# EAGLE design Gimbal_Breakout (EAGLE 6.6.0)
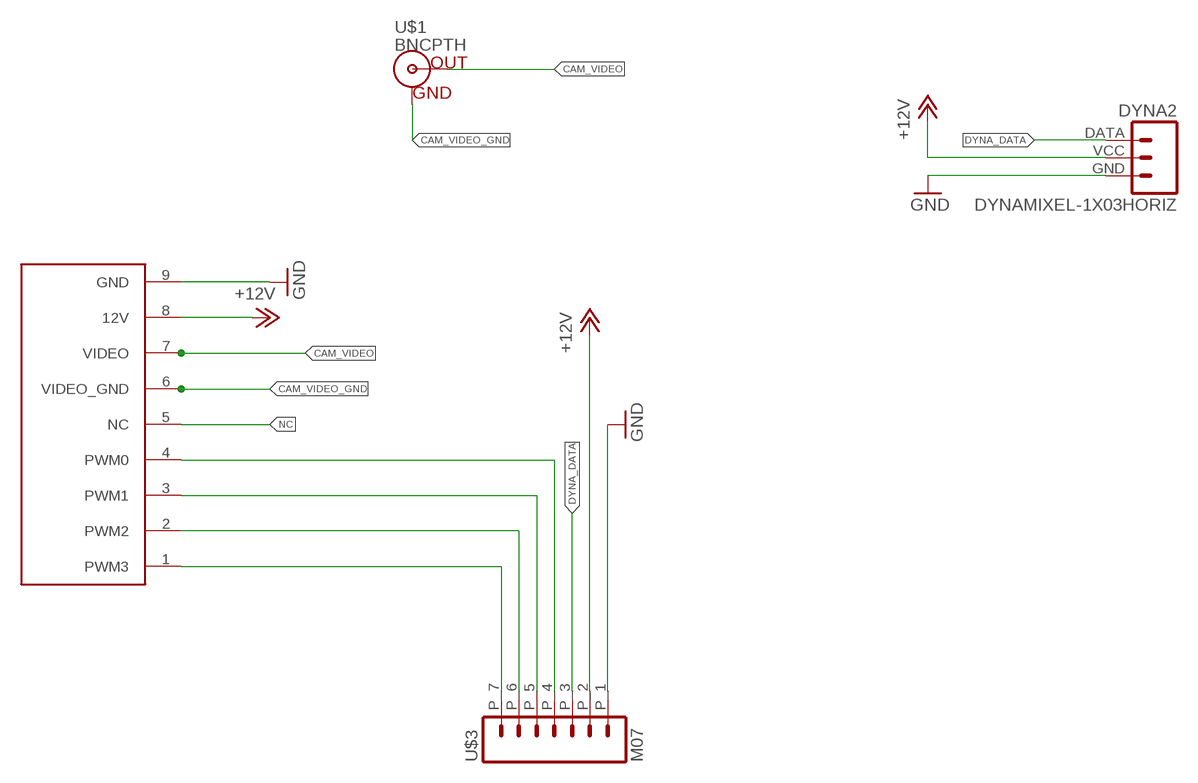
[diagram p0: schematic, sheet 1]

## Parts
DYNA2  DYNAMIXEL-1X03HORIZ  [MLX-SPOX5268-3PIN]
U$1  BNCPTH  [BNC]
U$3  M07  [MOLEX_43650-07]
U$4  CAMERA_BREAKOUT  [CAM_CONNECTOR]

## Nets
+12V: DYNA2.VCC U$3.P_2 U$4.8(12V)
CAM_PWM0: U$3.P_4 U$4.4(PWM0)
CAM_PWM1: U$3.P_5 U$4.3(PWM1)
CAM_PWM2: U$3.P_6 U$4.2(PWM2)
CAM_PWM3: U$3.P_7 U$4.1(PWM3)
CAM_VIDEO: U$1.S(OUT) U$4.7(VIDEO)
CAM_VIDEO_GND: U$1.GND U$4.6(VIDEO_GND)
DYNA_DATA: DYNA2.DATA U$3.P_3
GND: DYNA2.GND U$3.P_1 U$4.9(GND)
Unconnected: U$4.5(NC)

## Library data of the parts
DYNA2 = MRDT-2015-Arm:DYNAMIXEL-1X03; MFR: Molex; MFR_PN: 0022057035; ORIENT: Horiz
U$1 = SparkFun-Connectors:BNC: BNC Connector, Mouser Part# 5227161
U$3 = MRDT-Connectors:M07
U$4 = MRDT-2015-General:CAMERA_BREAKOUT: Breakout board for the rover's main camera

## Board
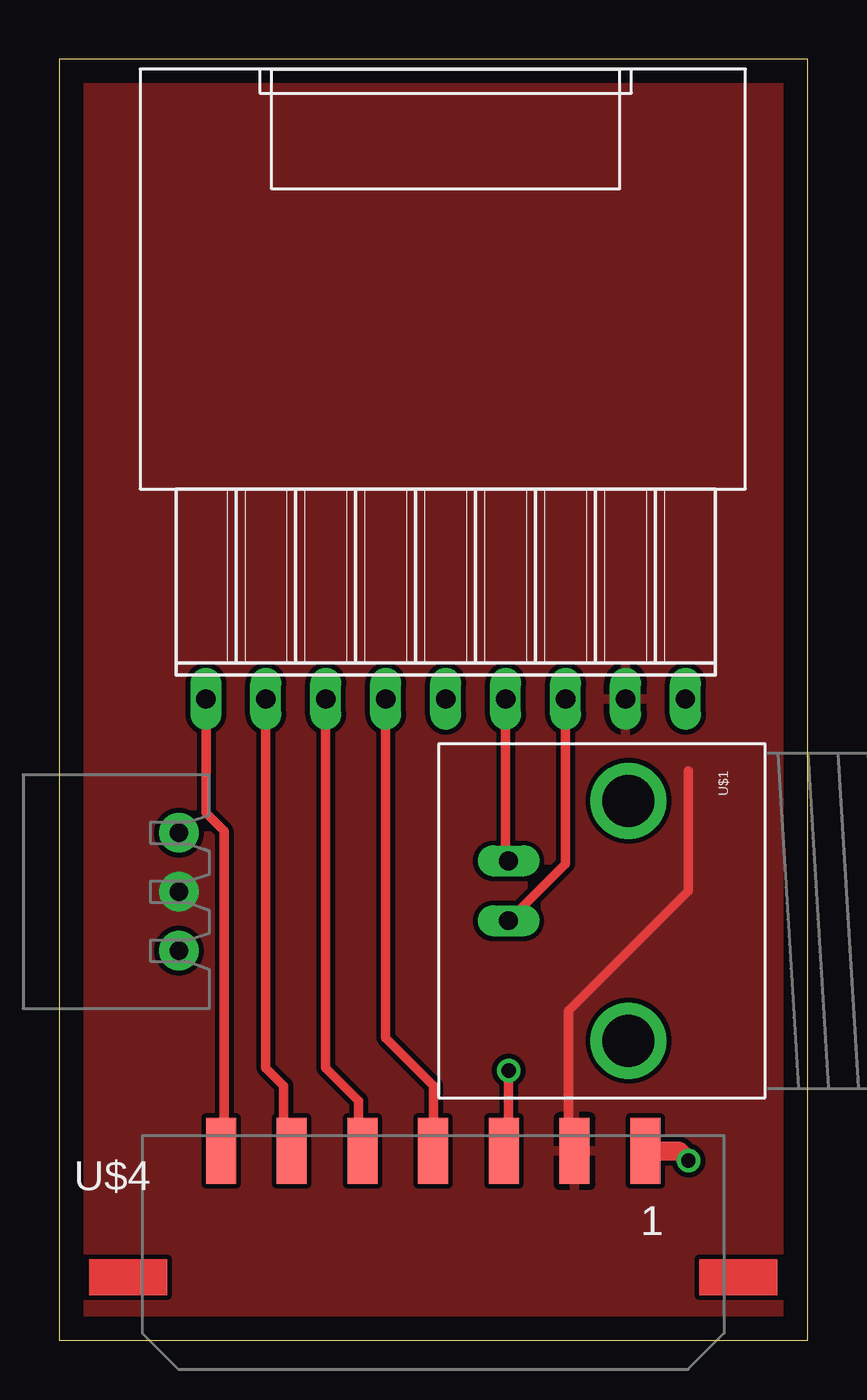
[diagram p1: board, top side]
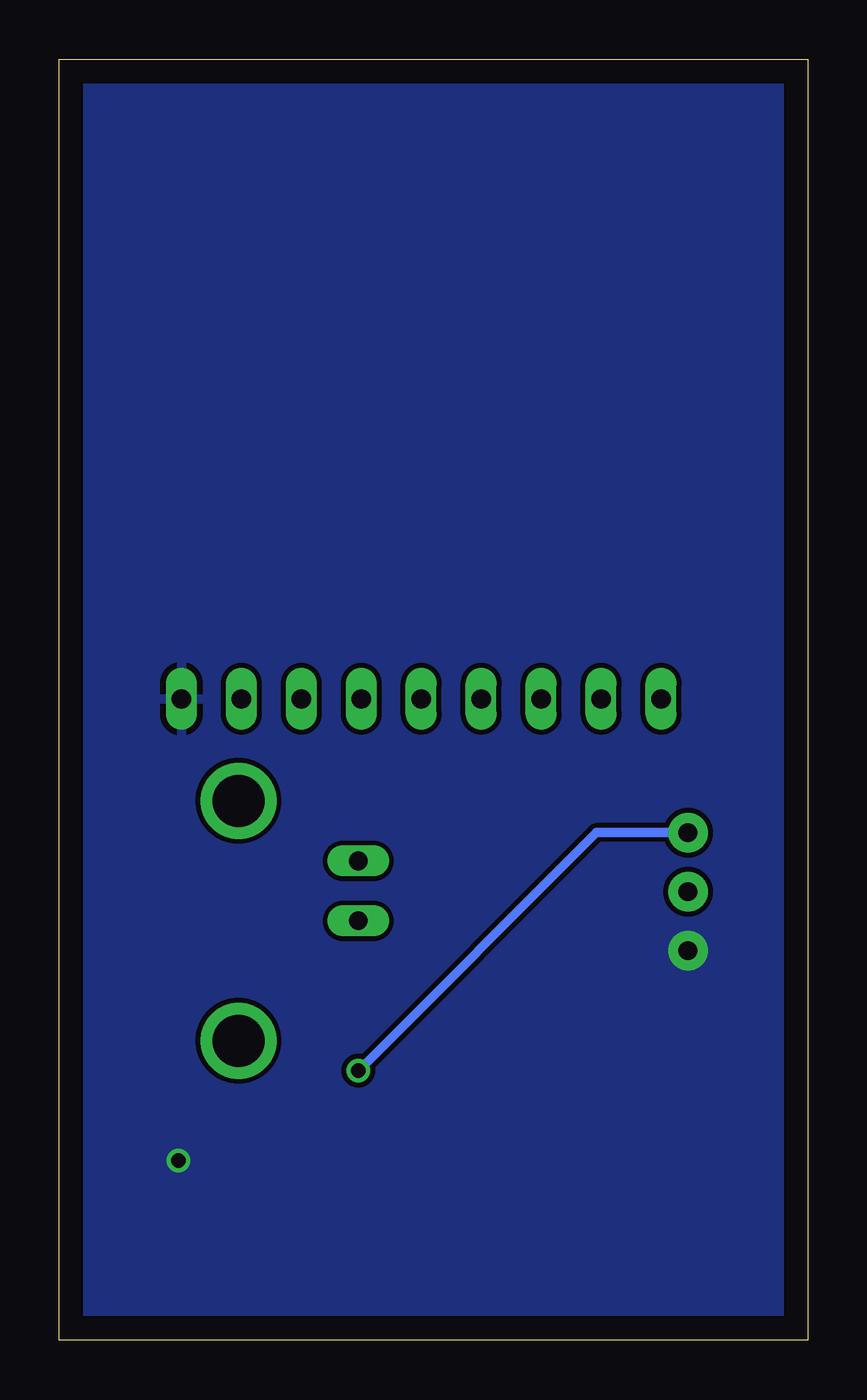
[diagram p2: board, bottom side, seen from below]

Size 31.73 x 54.28 mm. Coordinates in mm from the lower left corner, seen from the top.
Outline: 0,0 31.73,0 31.73,54.28 0,54.28 0,0
Copper layers (1*16): Top 0.035mm / dielectric 1.5mm / Bottom 0.035mm
Design rules "default": minimum track width 10mil, minimum drill 24mil, track to track 8mil, track to pad 8mil, pad to pad 8mil, via to via 8mil, smd to smd 8mil, copper to edge 40mil, drill to drill 8mil, minimum pad ring 10mil, minimum via ring 8mil, stop-mask expansion 4mil, vias tented up to drill 0mil, thermal gap 10mil

### Footprints (pad centres in the part's own frame; a part is rotated, then mirrored left to right if it is on the bottom)
MLX-SPOX5268-3PIN = drill 0.8 pad 1.676: DATA 5,0; GND 0,0; VCC 2.5,0
BNC = drill 2.2: 3 -5.08,5.08; 4 5.08,5.08 | drill 0.8 long: GND -2.54,0; S 0,0
MOLEX_43650-07 = smd 1.27 x 2.794: P_1 8.966,4.851; P_2 5.969,4.851; P_3 2.972,4.851; P_4 -0.025,4.851; P_5 -3.023,4.851; P_6 -6.02,4.851; P_7 -9.017,4.851
CAM_CONNECTOR = drill 0.813 long: 1 3.048,1.778; 2 5.588,1.778; 3 8.128,1.778; 4 10.668,1.778; 5 13.208,1.778; 6 15.748,1.778; 7 18.288,1.778; 8 20.828,1.778; 9 23.368,1.778

### Placement (x,y rotation side)
DYNA2  5.08,16.51 90 top
U$1  19.05,17.78 270 top
U$3  15.88,3.17 0 top
U$4  3.17,25.4 0 top

### Tracks (layer width: path | path; a pad name or v marks a point on that pad's centre or on a via)
+12V
  Top 0.406: U$4.8 24,26.8 | 26.67,24.13 26.67,19.05 21.59,13.97 21.59,8.28 U$3.P_2
  pour Top: -12.7,-7.62 58.42,-7.62 58.42,68.58 -12.7,68.58
CAM_PWM0
  Top 0.406: U$4.4 13.84,12.83 15.88,10.8 15.88,8.05 U$3.P_4
CAM_PWM1
  Top 0.406: U$4.3 11.3,11.56 12.7,10.16 12.7,8.18 U$3.P_5
CAM_PWM2
  Top 0.406: U$4.2 8.76,11.56 9.53,10.8 9.53,8.36 U$3.P_6
CAM_PWM3
  Top 0.406: U$4.1 6.22,22.35 6.98,21.59 6.98,8.15 U$3.P_7
CAM_VIDEO
  Top 0.406: U$4.7 21.46,20.19 U$1.S
CAM_VIDEO_GND
  Top 0.406: U$4.6 18.92,20.45 U$1.GND
DYNA_DATA  (via drill 0.6)
  Top 0.406: v19.05,11.43 19.05,8.23 U$3.P_3
  Bottom 0.406: DYNA2.DATA 8.97,21.51 v19.05,11.43
GND  (via drill 0.6)
  Top 0.813: U$3.P_1 26.26,8.03 v26.67,7.62
  pour Bottom: -7.62,-5.08 53.34,-5.08 53.34,64.77 -7.62,64.77